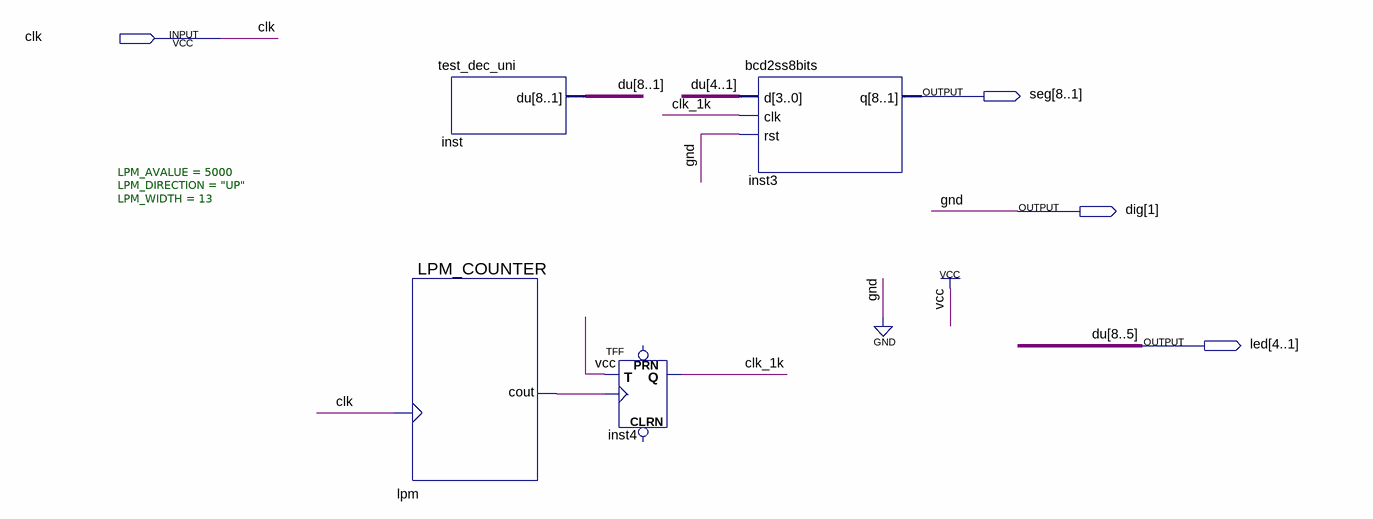
[diagram p0: schematic sheet]
// Quartus schematic test_bcd2ss.bdf as structural Verilog: 4 symbols, 4 pins
module test_bcd2ss (
  input  clk,
  output [8:1] seg,
  output [1:1] dig,
  output [4:1] led
);

  wire clk_1k, lpm_cout;
  wire [4:1] du;

  test_dec_uni inst (.du({led, du}));
  LPM_COUNTER #(.LPM_AVALUE(5000), .LPM_DIRECTION("UP"), .LPM_WIDTH(13)) lpm (.clock(clk), .cout(lpm_cout));
  TFF inst4 (.T(1'b1), .CLK(lpm_cout), .Q(clk_1k));  // open: PRN, CLRN
  bcd2ss8bits inst3 (.d(du), .clk(clk_1k), .rst(1'b0), .q(seg));

  assign dig[1] = 1'b0;

  // Other names for the same wires on the sheet: du[8:5] = led
endmodule
